# EAGLE design safe_code (EAGLE 9.6.2)
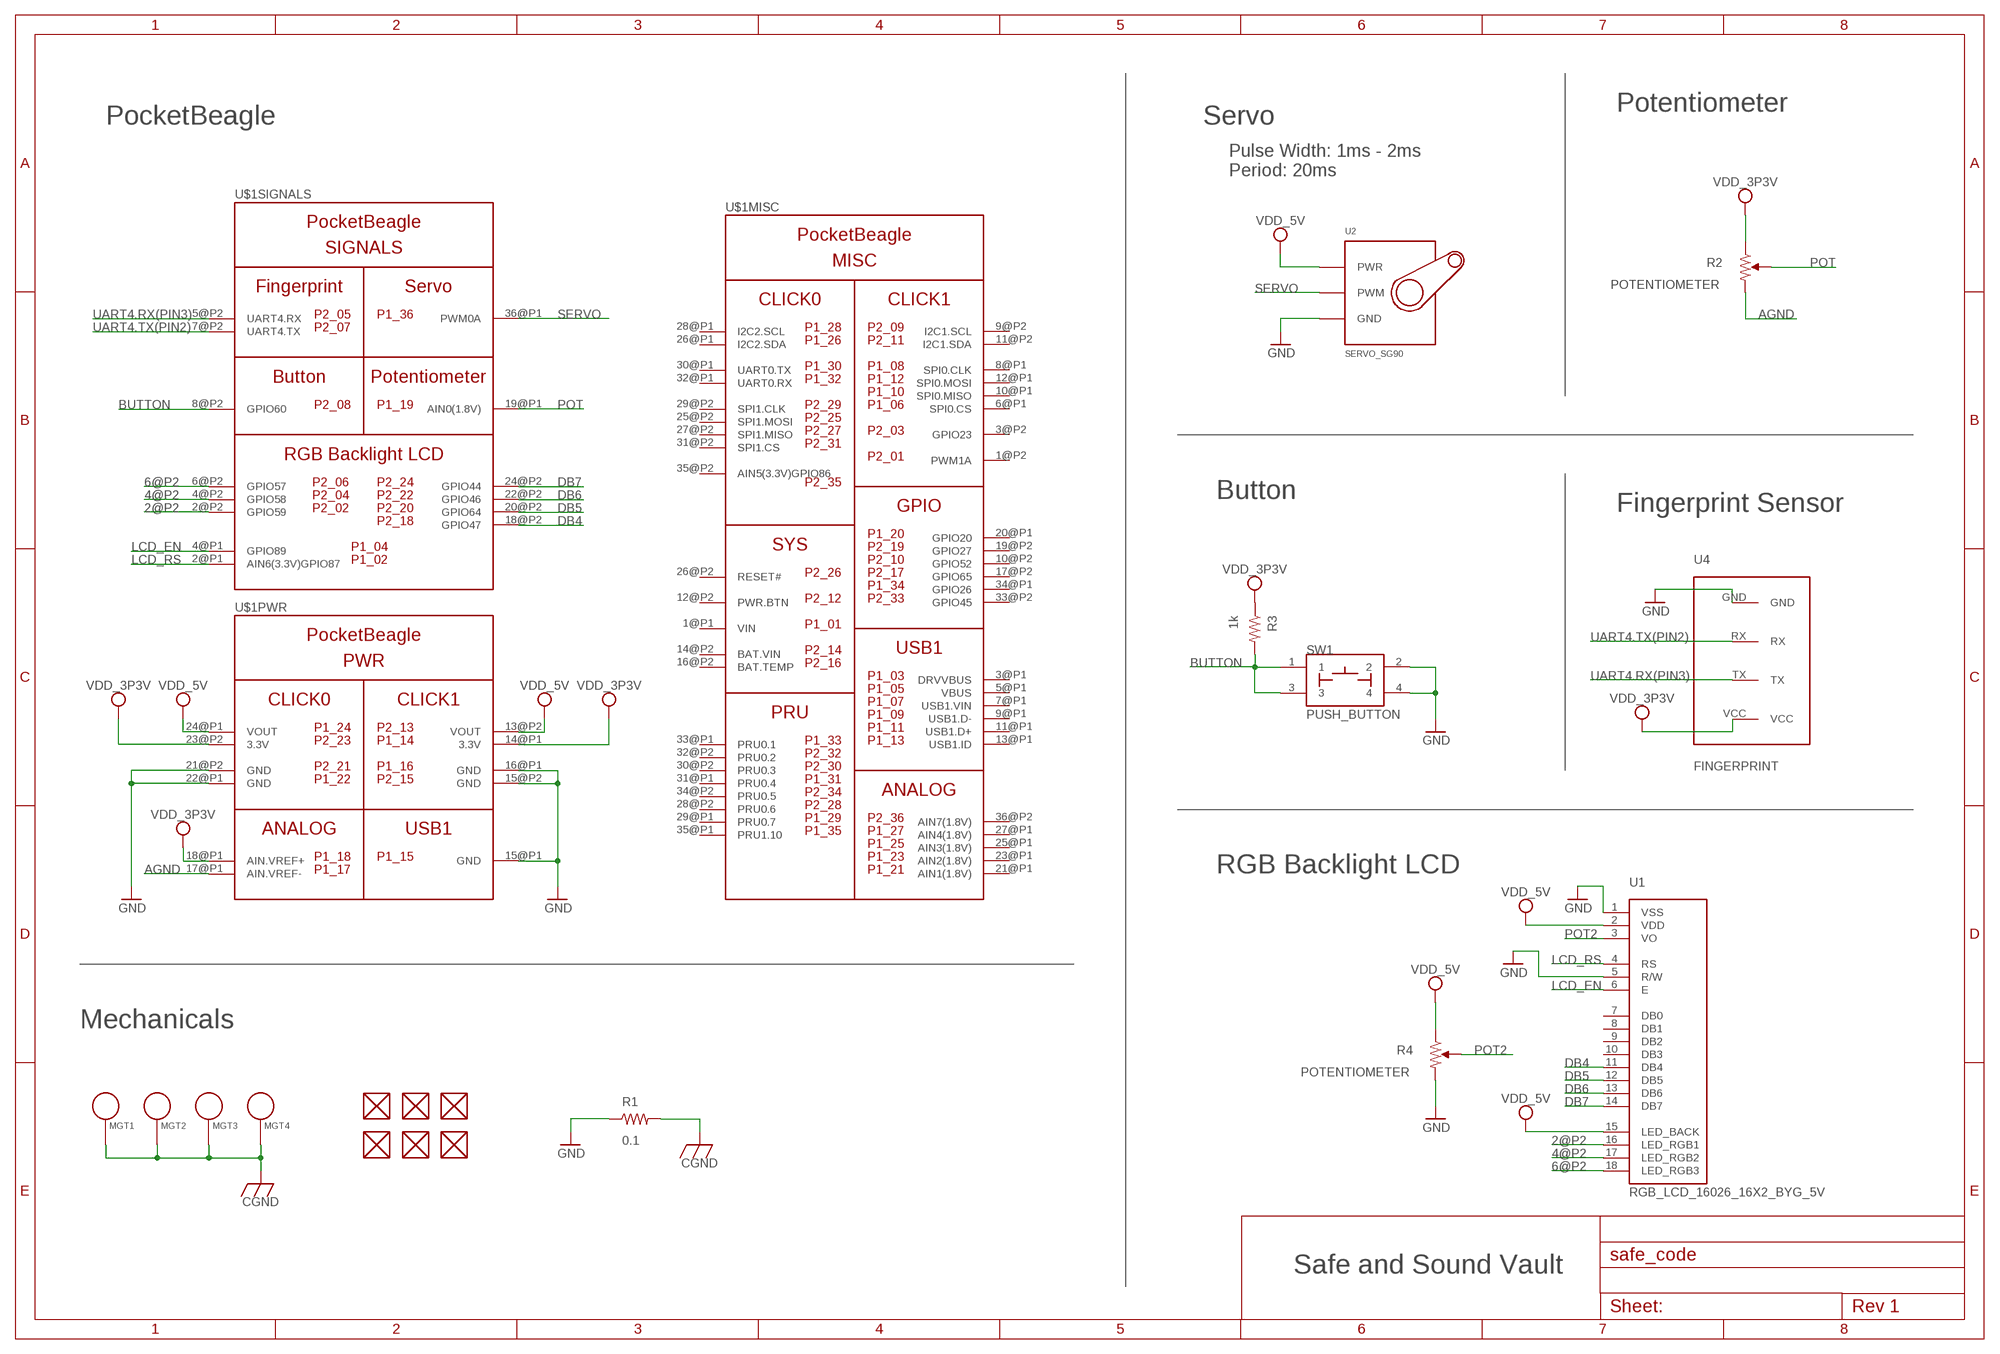
[diagram p0: schematic, sheet 1]

## Parts
FUD1  FIDUCIAL  [FIDUCIAL_40MIL]
FUD2  FIDUCIAL  [FIDUCIAL_40MIL]
FUD3  FIDUCIAL  [FIDUCIAL_40MIL]
FUD4  FIDUCIAL  [FIDUCIAL_40MIL]
FUD5  FIDUCIAL  [FIDUCIAL_40MIL]
FUD6  FIDUCIAL  [FIDUCIAL_40MIL]
MGT1  MOUNTING_HOLE  [MOUNTING_HOLE]
MGT2  MOUNTING_HOLE  [MOUNTING_HOLE]
MGT3  MOUNTING_HOLE  [MOUNTING_HOLE]
MGT4  MOUNTING_HOLE  [MOUNTING_HOLE]
R1  0.1  R_R0603  [R0603]
R2  POTENTIOMETER  [POT-PO90S]
R3  1k  R_R0603  [R0603]
R4  POTENTIOMETER  [POT-PO90S]
SW1  PUSH_BUTTON  [BUTTON_12.5MM]
U1  RGB_LCD_16026_16X2_BYG_5V  [RGB_LCD]
U2  SERVO_SG90  [SERVO-X1]
U4  FINGERPRINT  [FINGERPRINT]
U$1  POCKETBEAGLE_2  [POCKETBEAGLE_2]

## Nets
2@P2: U1.16(LED_RGB1) U$1.2@P2(SIGNALS:GPIO59)
4@P2: U1.17(LED_RGB2) U$1.4@P2(SIGNALS:GPIO58)
6@P2: U1.18(LED_RGB3) U$1.6@P2(SIGNALS:GPIO57)
AGND: R2.CW U$1.17@P1(PWR:AIN.VREF-)
BUTTON: R3.2 SW1.1 SW1.3 U$1.8@P2(SIGNALS:GPIO60)
CGND: MGT1.P$1 MGT2.P$1 MGT3.P$1 MGT4.P$1 R1.2
DB4: U1.11(DB4) U$1.18@P2(SIGNALS:GPIO47)
DB5: U1.12(DB5) U$1.20@P2(SIGNALS:GPIO64)
DB6: U1.13(DB6) U$1.22@P2(SIGNALS:GPIO46)
DB7: U1.14(DB7) U$1.24@P2(SIGNALS:GPIO44)
GND: R1.1 R4.CW SW1.2 SW1.4 U1.1(VSS) U1.5(R/W) U2.GND U4.GND U$1.15@P1(PWR:GND) U$1.15@P2(PWR:GND) U$1.16@P1(PWR:GND) U$1.21@P2(PWR:GND) U$1.22@P1(PWR:GND)
LCD_EN: U1.6(E) U$1.4@P1(SIGNALS:GPIO89)
LCD_RS: U1.4(RS) U$1.2@P1(SIGNALS:AIN6(3.3V)GPIO87)
N$1: U$1.13@P2(PWR:VOUT) ; supply symbol labelled VDD_5V
POT: R2.S U$1.19@P1(SIGNALS:AIN0(1.8V))
POT2: R4.S U1.3(VO)
SERVO: U2.SIG(PWM) U$1.36@P1(SIGNALS:PWM0A)
UART4.RX(PIN3): U4.TX U$1.5@P2(SIGNALS:UART4.RX)
UART4.TX(PIN2): U4.RX U$1.7@P2(SIGNALS:UART4.TX)
VDD_3P3V: R2.CCW R3.1 U4.VCC U$1.14@P1(PWR:3.3V) U$1.18@P1(PWR:AIN.VREF+) U$1.23@P2(PWR:3.3V)
VDD_5V: R4.CCW U1.2(VDD) U1.15(LED_BACK) U2.PWR U$1.24@P1(PWR:VOUT)
Unconnected: FUD1.P$1 FUD2.P$1 FUD3.P$1 FUD4.P$1 FUD5.P$1 FUD6.P$1 U1.7(DB0) U1.8(DB1) U1.9(DB2) U1.10(DB3) U$1.1@P2(MISC:PWM1A) U$1.3@P1(MISC:DRVVBUS) U$1.3@P2(MISC:GPIO23) U$1.5@P1(MISC:VBUS) U$1.6@P1(MISC:SPI0.CS) U$1.7@P1(MISC:USB1.VIN) U$1.8@P1(MISC:SPI0.CLK) U$1.9@P1(MISC:USB1.D-) U$1.9@P2(MISC:I2C1.SCL) U$1.10@P1(MISC:SPI0.MISO) U$1.10@P2(MISC:GPIO52) U$1.11@P1(MISC:USB1.D+) U$1.11@P2(MISC:I2C1.SDA) U$1.12@P1(MISC:SPI0.MOSI) U$1.12@P2(MISC:PWR.BTN) U$1.13@P1(MISC:USB1.ID) U$1.16@P2(MISC:BAT.TEMP) U$1.17@P2(MISC:GPIO65) U$1.19@P2(MISC:GPIO27) U$1.20@P1(MISC:GPIO20) U$1.21@P1(MISC:AIN1(1.8V)) U$1.23@P1(MISC:AIN2(1.8V)) U$1.25@P1(MISC:AIN3(1.8V)) U$1.25@P2(MISC:SPI1.MOSI) U$1.26@P1(MISC:I2C2.SDA) U$1.26@P2(MISC:RESET#) U$1.27@P1(MISC:AIN4(1.8V)) U$1.27@P2(MISC:SPI1.MISO) U$1.28@P1(MISC:I2C2.SCL) U$1.28@P2(MISC:PRU0.6) U$1.29@P1(MISC:PRU0.7) U$1.29@P2(MISC:SPI1.CLK) U$1.30@P1(MISC:UART0.TX) U$1.30@P2(MISC:PRU0.3) U$1.31@P1(MISC:PRU0.4) U$1.31@P2(MISC:SPI1.CS) U$1.32@P1(MISC:UART0.RX) U$1.32@P2(MISC:PRU0.2) U$1.33@P1(MISC:PRU0.1) U$1.33@P2(MISC:GPIO45) U$1.34@P1(MISC:GPIO26) U$1.34@P2(MISC:PRU0.5) U$1.35@P1(MISC:PRU1.10) U$1.35@P2(MISC:AIN5(3.3V)GPIO86) U$1.36@P2(MISC:AIN7(1.8V))

## Notes on the sheet
- Potentiometer
- PocketBeagle | Servo
- Pulse Width: 1ms - 2ms
  Period: 20ms
- Button
- Fingerprint Sensor
- RGB Backlight LCD
- Mechanicals
- Safe and Sound Vault

## Power pins joined to a net without a drawn wire
BAT.VIN: U$1.14@P2(MISC:BAT.VIN)
VIN: U$1.1@P1(MISC:VIN)

## Library data of the parts
FUD1-FUD6 = safe_code:FIDUCIAL
MGT1-MGT4 = safe_code:MOUNTING_HOLE: Chassis Mounting Hole w/GND connection ability
R1 R3 = safe_code:R_: RESISTOR, American symbol
R2 R4 = safe_code:POTENTIOMETER: Potentiometer - Examples: P090S-14T20BR10K (987-1277-ND)
SW1 = safe_code:PUSH_BUTTON
U1 = safe_code:RGB_LCD: Display; Display: LCD 2x16 characters (blue backlight) Check availability <https://pricing.snapeda.com/parts/LCD2X16/mikroElektronika/view-part?ref=eda>; AVAILABILITY: Not in stock; CHECK_PRICES: https://www.snapeda.com/parts/LCD2X16/mikroElektronika/view-part/?ref=eda; DESCRIPTION: Display; Display: LCD 2x16 characters (blue backlight); MF: mikroElektronika; MP: LCD2X16; PACKAGE: None; PRICE: None; SNAPEDA_LINK: https://www.snapeda.com/parts/LCD2X16/mikroElektronika/view-part/?ref=snap
U2 = safe_code:SERVO_SG90
U4 = safe_code:FINGERPRINT
U$1 = safe_code:POCKETBEAGLE_2

## Board
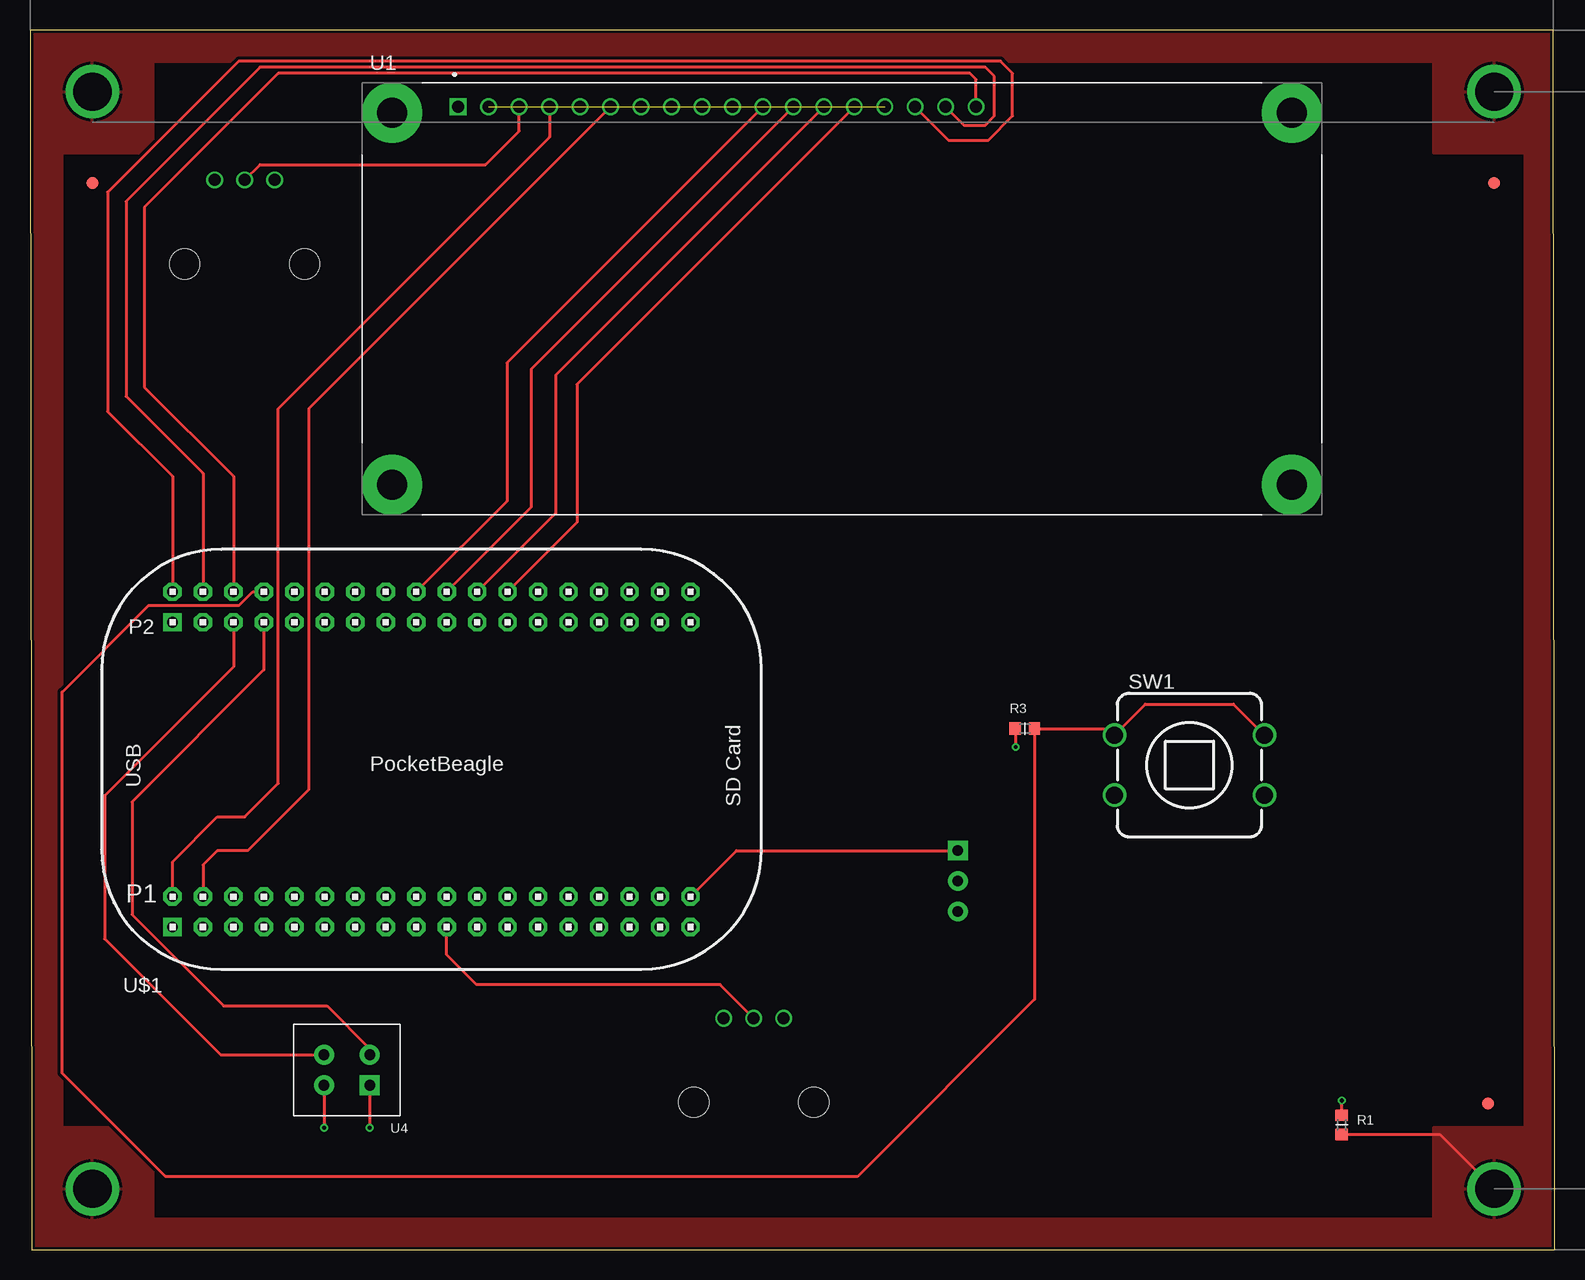
[diagram p1: board, top side]
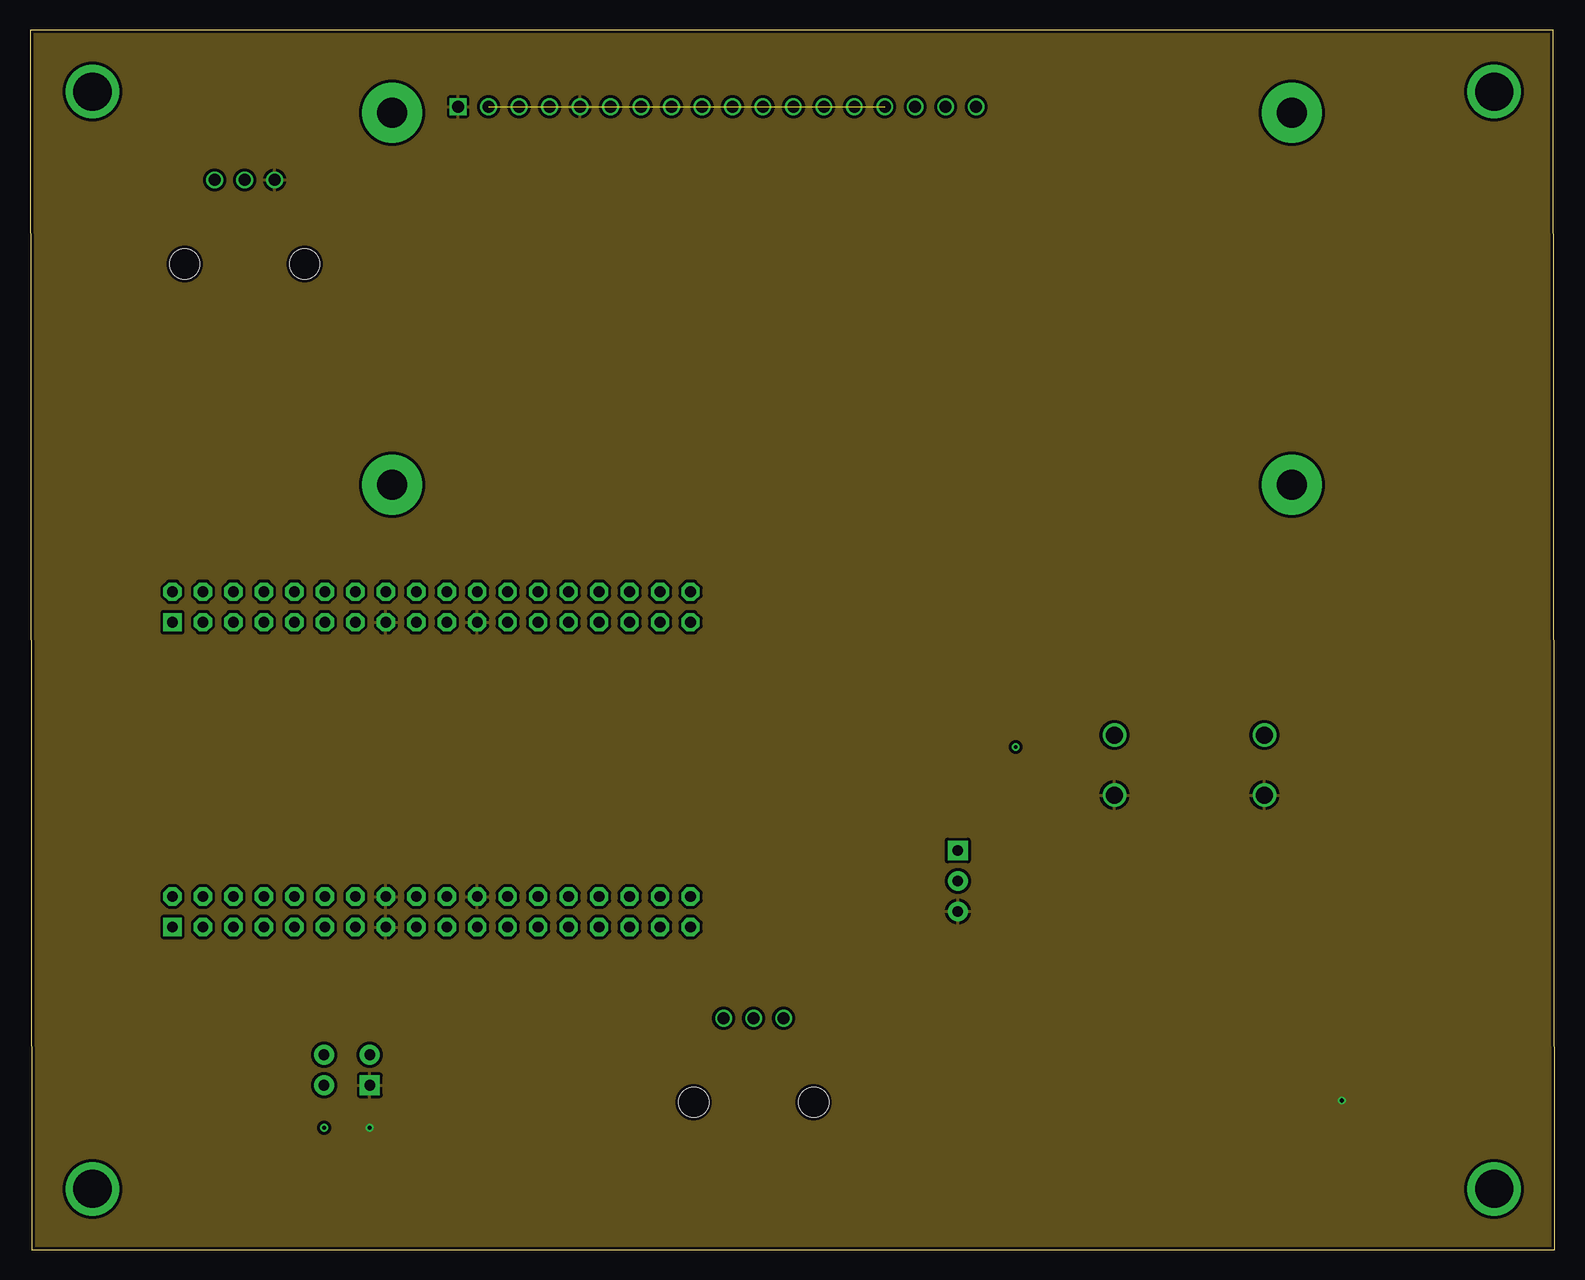
[diagram p2: board, inner layer Route2]
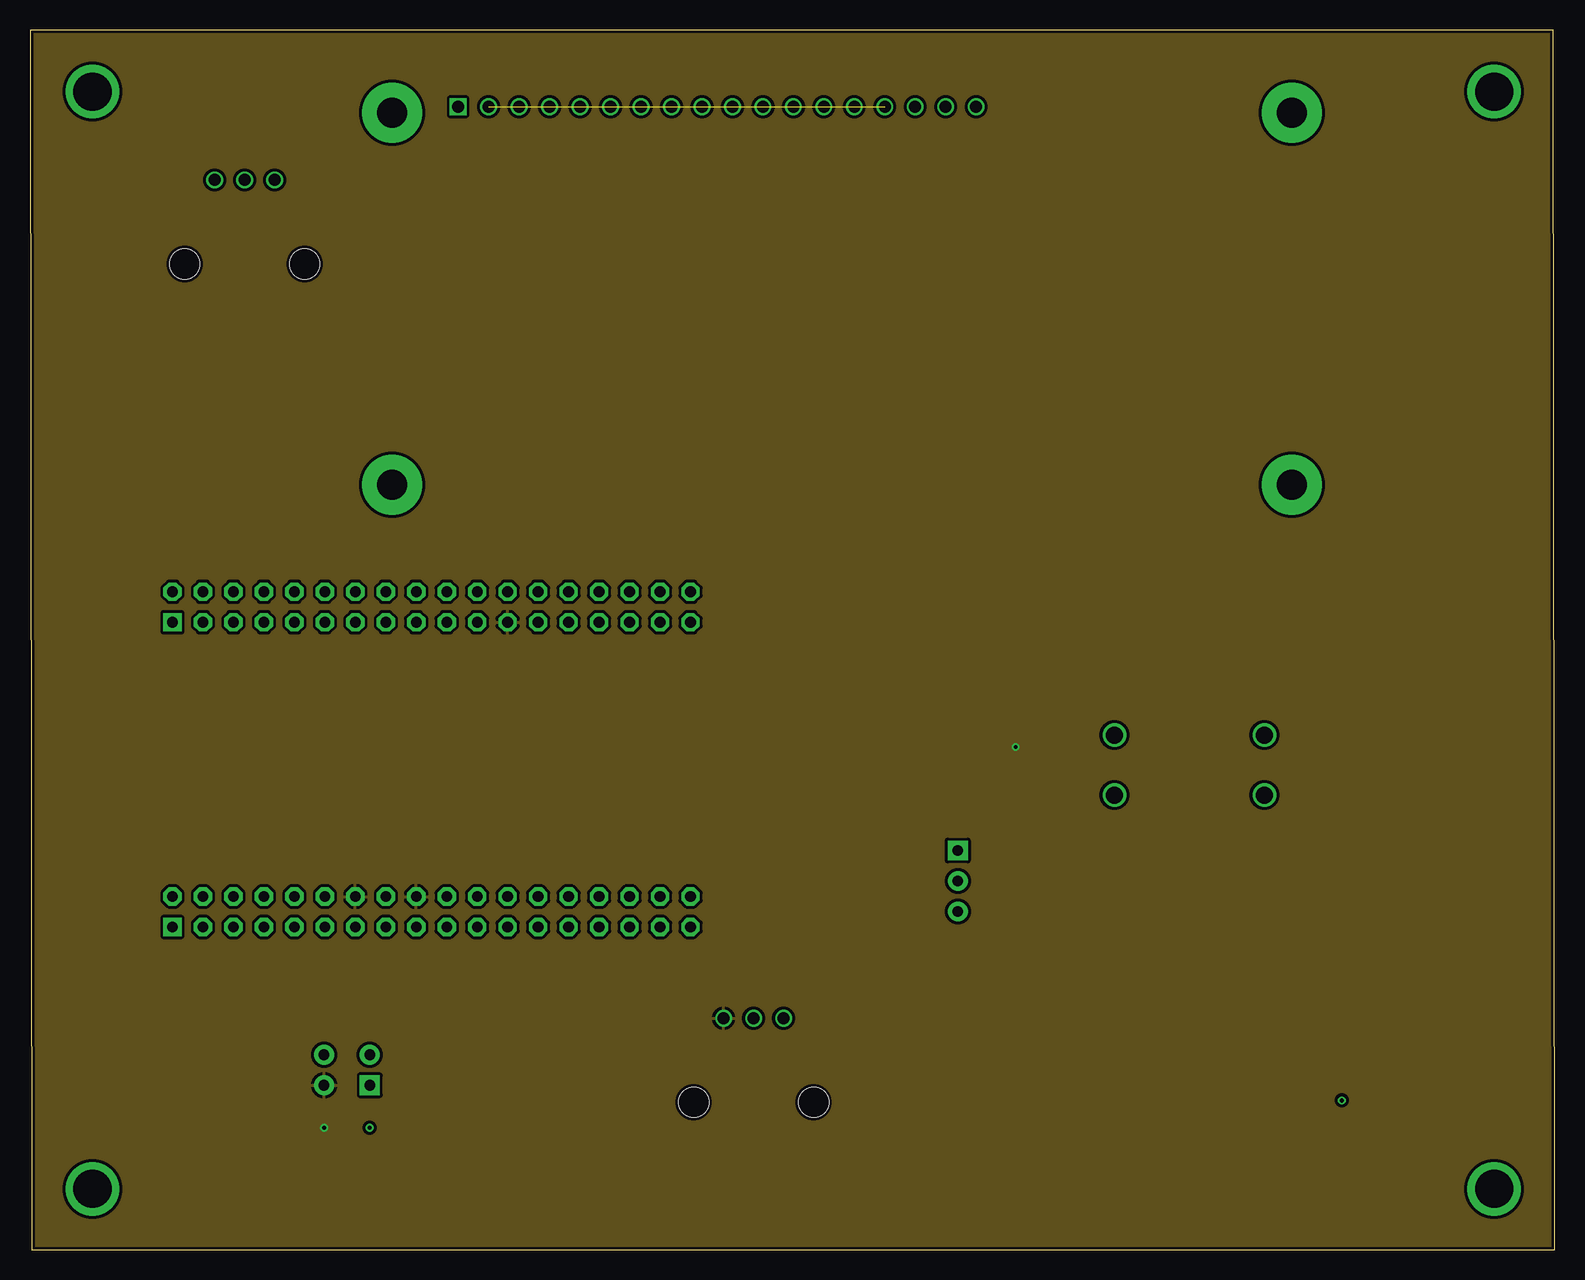
[diagram p3: board, inner layer Route15]
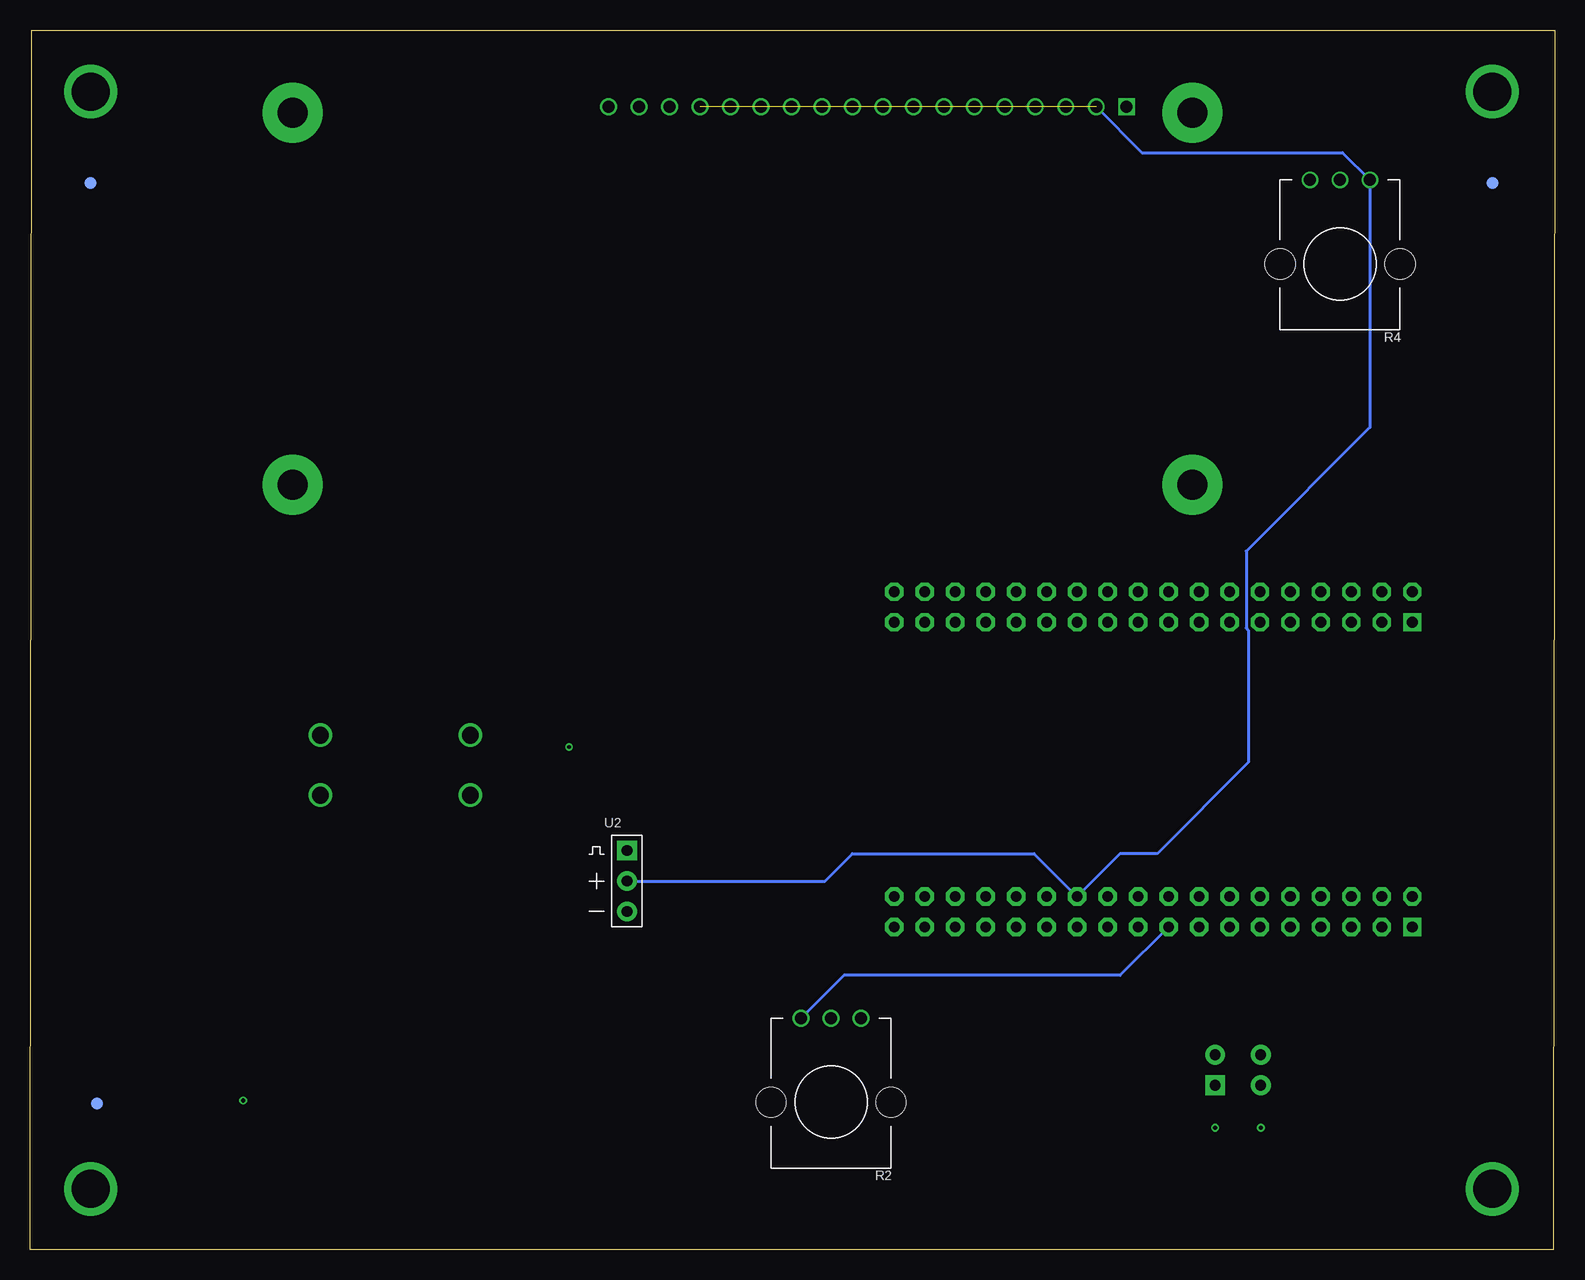
[diagram p4: board, bottom side, seen from below]

Size 127.11 x 101.65 mm. Coordinates in mm from the lower left corner, seen from the top.
Outline: 0.13,0 127.11,0 126.98,101.65 0,101.65 0.13,0
Copper layers (1*2*15*16): Top 0.035mm / dielectric 0.23mm / Route2 0.035mm / dielectric 0.93mm / Route15 0.035mm / dielectric 0.23mm / Bottom 0.035mm
Design rules "ENGI301_4lyr": minimum track width 10mil, minimum drill 12mil, track to track 10mil, track to pad 10mil, pad to pad 10mil, via to via 10mil, smd to smd 10mil, copper to edge 10mil, drill to drill 12mil, minimum pad ring 6mil, minimum via ring 6mil, stop-mask expansion 3mil, vias tented up to drill 25mil, thermal gap 10mil

### Footprints (pad centres in the part's own frame; a part is rotated, then mirrored left to right if it is on the bottom)
FIDUCIAL_40MIL = smd 1.016 x 1.016: P$1 0,0
MOUNTING_HOLE = drill 3.175 pad 4.445: P$1 0,0
R0603 = smd 0.95 x 1.031: 1 -0.8,0; 2 0.8,0
POT-PO90S = drill 1: CCW -2.5,0; CW 2.5,0; S 0,0 | hole 2.5: -5,7; 5,7
BUTTON_12.5MM = drill 1.4: 1 -6.25,2.5; 2 -6.25,-2.5; 3 6.25,2.5; 4 6.25,-2.5
RGB_LCD = drill 1 square: 1 -32,16 | drill 1: 2 -29.46,16; 3 -26.92,16; 4 -24.38,16; 5 -21.84,16; 6 -19.3,16; 7 -16.76,16; 8 -14.22,16; 9 -11.68,16; 10 -9.14,16; 11 -6.6,16; 12 -4.06,16; 13 -1.52,16; 14 1.02,16; 15 3.56,16; 16 6.1,16; 17 8.64,16; 18 11.18,16 | drill 2.5 pad 5: S1 -37.5,15.5; S2 37.5,15.5; S3 37.5,-15.5; S4 -37.5,-15.5
SERVO-X1 = drill 0.889 pad 1.651: GND 0,-2.54; PWR 0,0 | drill 0.889 pad 1.651 square: SIG 0,2.54
FINGERPRINT = drill 0.889 pad 1.651 square: GND 2.54,5.08 | drill 0.889 pad 1.651: RX 2.54,2.54; TX 6.35,2.54; VCC 6.35,5.08
POCKETBEAGLE_2 = drill 0.889 pad 1.524 square: 1@P1 5.91,3.53; 1@P2 5.91,28.93 | drill 0.889 pad 1.524 octagon: 2@P1 5.91,6.07; 2@P2 5.91,31.47; 3@P1 8.45,3.53; 3@P2 8.45,28.93; 4@P1 8.45,6.07; 4@P2 8.45,31.47; 5@P1 10.99,3.53; 5@P2 10.99,28.93; 6@P1 10.99,6.07; 6@P2 10.99,31.47; 7@P1 13.53,3.53; 7@P2 13.53,28.93; 8@P1 13.53,6.07; 8@P2 13.53,31.47; 9@P1 16.07,3.53; 9@P2 16.07,28.93; 10@P1 16.07,6.07; 10@P2 16.07,31.47; 11@P1 18.61,3.53; 11@P2 18.61,28.93; 12@P1 18.61,6.07; 12@P2 18.61,31.47; 13@P1 21.15,3.53; 13@P2 21.15,28.93; 14@P1 21.15,6.07; 14@P2 21.15,31.47; 15@P1 23.69,3.53; 15@P2 23.69,28.93; 16@P1 23.69,6.07; 16@P2 23.69,31.47; 17@P1 26.23,3.53; 17@P2 26.23,28.93; 18@P1 26.23,6.07; 18@P2 26.23,31.47; 19@P1 28.77,3.53; 19@P2 28.77,28.93; 20@P1 28.77,6.07; 20@P2 28.77,31.47; 21@P1 31.31,3.53; 21@P2 31.31,28.93; 22@P1 31.31,6.07; 22@P2 31.31,31.47; 23@P1 33.85,3.53; 23@P2 33.85,28.93; 24@P1 33.85,6.07; 24@P2 33.85,31.47; 25@P1 36.39,3.53; 25@P2 36.39,28.93; 26@P1 36.39,6.07; 26@P2 36.39,31.47; 27@P1 38.93,3.53; 27@P2 38.93,28.93; 28@P1 38.93,6.07; 28@P2 38.93,31.47; 29@P1 41.47,3.53; 29@P2 41.47,28.93; 30@P1 41.47,6.07; 30@P2 41.47,31.47; 31@P1 44.01,3.53; 31@P2 44.01,28.93; 32@P1 44.01,6.07; 32@P2 44.01,31.47; 33@P1 46.55,3.53; 33@P2 46.55,28.93; 34@P1 46.55,6.07; 34@P2 46.55,31.47; 35@P1 49.09,3.53; 35@P2 49.09,28.93; 36@P1 49.09,6.07; 36@P2 49.09,31.47

### Placement (x,y rotation side)
FUD1  122.05,88.9 90 bottom
FUD2  121.54,12.19 90 bottom
FUD3  121.54,12.19 90 top
FUD4  122.05,88.9 90 top
FUD5  5.21,88.9 90 top
FUD6  5.21,88.9 0 bottom
MGT1  5.21,5.08 90 top
MGT2  122.05,5.08 90 top
MGT3  122.05,96.52 90 top
MGT4  5.21,96.52 90 top
R1  109.35,10.41 270 top
R2  60.33,19.3 180 bottom
R3  82.93,43.43 0 top
R4  17.91,89.15 180 bottom
SW1  96.65,40.39 0 top
U1  67.69,79.25 0 top
U2  77.34,30.73 0 bottom
U4  30.86,18.8 180 top
U$1  5.97,23.37 0 top

### Tracks (layer width: path | path; a pad name or v marks a point on that pad's centre or on a via)
2@P2
  Top 0.254: U1.16 76.58,92.46 79.88,92.46 81.91,94.49 81.91,98.04 80.9,99.06 17.4,99.06 6.48,88.14 6.48,69.85 11.88,64.45 U$1.2@P2
4@P2
  Top 0.254: U1.17 77.85,93.73 79.63,93.73 80.39,94.49 80.39,97.79 79.63,98.55 19.18,98.55 8,87.38 8,71.12 14.42,64.7 U$1.4@P2
6@P2
  Top 0.254: U1.18 78.87,97.53 78.36,98.04 20.7,98.04 9.53,86.87 9.53,71.88 16.96,64.45 U$1.6@P2
AGND
  Bottom 0.254: U$1.17@P1 36.24,22.86 59.27,22.86 R2.CW
BUTTON
  Top 0.254: 83.66,43.43 R3.2 | R3.2 89.85,43.43 SW1.1 92.98,45.47 100.32,45.47 SW1.3 | R3.2 83.73,20.87 68.96,6.1 11.3,6.1 2.67,14.73 2.67,46.48 9.88,53.7 17.43,53.7 18.57,54.84 U$1.8@P2
CGND
  Top 0.254: R1.2 117.51,9.61 MGT2.P$1
  pour Top: 2.67,91.44 10.29,91.44 10.29,99.06 116.97,99.06 116.97,91.44 124.59,91.44 124.59,58.42 129.67,58.42 129.67,104.14 -2.41,104.14 -2.41,60.96 2.67,60.96
  pour Top: -2.41,60.96 -2.41,-2.54 129.67,-2.54 129.67,58.42 124.59,58.42 124.59,10.16 116.97,10.16 116.97,2.54 10.29,2.54 10.29,10.16 2.67,10.16 2.67,60.96
DB4
  Top 0.254: U1.11 39.75,73.91 39.75,62.39 U$1.18@P2
DB5
  Top 0.254: U1.12 41.78,73.4 41.78,61.88 U$1.20@P2
DB6
  Top 0.254: U1.13 43.82,72.89 43.82,61.37 U$1.22@P2
DB7
  Top 0.254: U1.14 45.59,72.13 45.59,60.61 U$1.24@P2
GND  (via drill 0.35)
  Top 0.254: U4.GND v28.32,10.16 | R1.1 v109.35,12.45
  pour Route2: -4.95,-5.08 132.21,-5.08 132.21,106.68 -4.95,106.68
LCD_EN
  Top 0.254: U$1.4@P1 14.42,32.07 15.62,33.27 18.16,33.27 23.24,38.35 23.24,70.1 U1.6
LCD_RS
  Top 0.254: U1.4 43.31,92.71 20.7,70.1 20.7,38.86 17.91,36.07 15.62,36.07 11.88,32.33 U$1.2@P1
POT
  Top 0.254: R2.S 57.53,22.1 37.21,22.1 34.74,24.57 U$1.19@P1
POT2
  Top 0.254: R4.S 19.18,90.42 37.97,90.42 40.77,93.22 U1.3
SERVO
  Top 0.254: U$1.36@P1 58.9,33.27 U2.SIG
UART4.RX(PIN3)
  Top 0.254: U$1.5@P2 16.96,48.58 6.22,37.85 6.22,25.91 15.88,16.26 U4.TX
UART4.TX(PIN2)
  Top 0.254: U$1.7@P2 19.5,48.33 8.51,37.34 8.51,27.94 16.13,20.32 24.77,20.32 28.32,16.76 U4.RX
VDD_3P3V  (via drill 0.3 pad 0.61, 0.35)
  Top 0.254: 82.17,43.43 R3.1 82.13,41.95 v82.17,41.91 | U4.VCC v24.51,10.16
  pour Route15 (rank 6): -7.49,109.22 -7.49,-7.62 134.75,-7.62 134.75,109.22
VDD_5V  (1 unrouted)
  Bottom 0.254: U1.2 34.42,91.44 17.69,91.44 R4.CCW 15.41,68.54 25.72,58.23 25.72,51.83 25.53,51.63 25.53,40.64 33.15,33.02 36.24,33.02 U$1.24@P1 43.4,33.02 58.55,33.02 60.83,30.73 U2.PWR